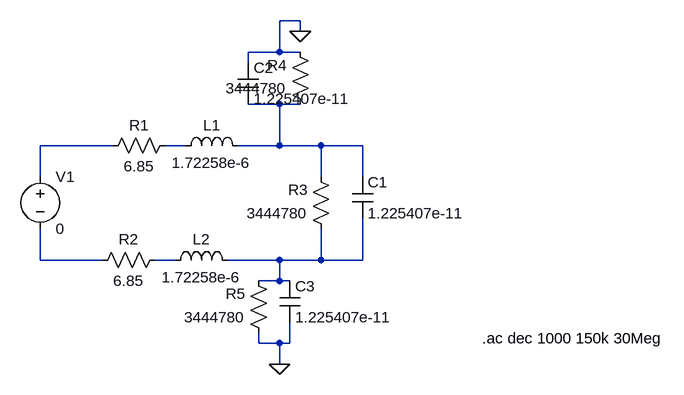
[diagram p0: schematic 2m_cable_model_01.asc]
2m_cable_model_01.asc, the LTspice schematic file:
Version 4
SHEET 1 1048 680
WIRE 480 80 448 80
WIRE 480 96 480 80
WIRE 448 128 448 80
WIRE 448 128 400 128
WIRE 480 128 448 128
WIRE 400 144 400 128
WIRE 448 208 400 208
WIRE 480 208 448 208
WIRE 192 272 80 272
WIRE 304 272 272 272
WIRE 448 272 448 208
WIRE 448 272 384 272
WIRE 512 272 448 272
WIRE 576 272 512 272
WIRE 80 320 80 272
WIRE 512 320 512 272
WIRE 576 320 576 272
WIRE 80 448 80 400
WIRE 176 448 80 448
WIRE 288 448 256 448
WIRE 448 448 368 448
WIRE 512 448 512 400
WIRE 512 448 448 448
WIRE 576 448 576 384
WIRE 576 448 512 448
WIRE 448 480 448 448
WIRE 448 480 416 480
WIRE 464 480 448 480
WIRE 416 576 416 560
WIRE 448 576 416 576
WIRE 464 576 464 544
WIRE 464 576 448 576
WIRE 448 608 448 576
FLAG 448 608 0
FLAG 480 96 0
SYMBOL voltage 80 304 R0
SYMATTR InstName V1
SYMATTR Value 0
SYMATTR Value2 AC 1 0
SYMBOL res 288 256 R90
WINDOW 0 0 56 VBottom 2
WINDOW 3 32 56 VTop 2
SYMATTR InstName R1
SYMATTR Value 6.85
SYMBOL res 272 432 R90
WINDOW 0 0 56 VBottom 2
WINDOW 3 32 56 VTop 2
SYMATTR InstName R2
SYMATTR Value 6.85
SYMBOL res 528 416 R180
WINDOW 0 36 76 Left 2
WINDOW 3 36 40 Left 2
SYMATTR InstName R3
SYMATTR Value 3444780
SYMBOL res 496 224 R180
WINDOW 0 36 76 Left 2
WINDOW 3 36 40 Left 2
SYMATTR InstName R4
SYMATTR Value 3444780
SYMBOL res 432 576 R180
WINDOW 0 36 76 Left 2
WINDOW 3 36 40 Left 2
SYMATTR InstName R5
SYMATTR Value 3444780
SYMBOL cap 560 320 R0
SYMATTR InstName C1
SYMATTR Value 1.225407e-11
SYMBOL cap 384 144 R0
SYMATTR InstName C2
SYMATTR Value 1.225407e-11
SYMBOL cap 448 480 R0
SYMATTR InstName C3
SYMATTR Value 1.225407e-11
SYMBOL ind 288 288 R270
WINDOW 0 32 56 VTop 2
WINDOW 3 5 56 VBottom 2
SYMATTR InstName L1
SYMATTR Value 1.72258e-6
SYMBOL ind 272 464 R270
WINDOW 0 32 56 VTop 2
WINDOW 3 5 56 VBottom 2
SYMATTR InstName L2
SYMATTR Value 1.72258e-6
TEXT 760 568 Left 2 !.ac dec 1000 150k 30Meg

The netlist it stands for:
* 2m_cable_model_01.asc
V1 N002 N004 0 AC 1 0
R1 N003 N002 6.85
R2 N005 N004 6.85
R3 N006 N001 3444780
R4 N001 0 3444780
R5 0 N006 3444780
C1 N001 N006 1.225407e-11
C2 0 N001 1.225407e-11
C3 N006 0 1.225407e-11
L1 N003 N001 1.72258e-6
L2 N005 N006 1.72258e-6
.ac dec 1000 150k 30Meg
.backanno
.end